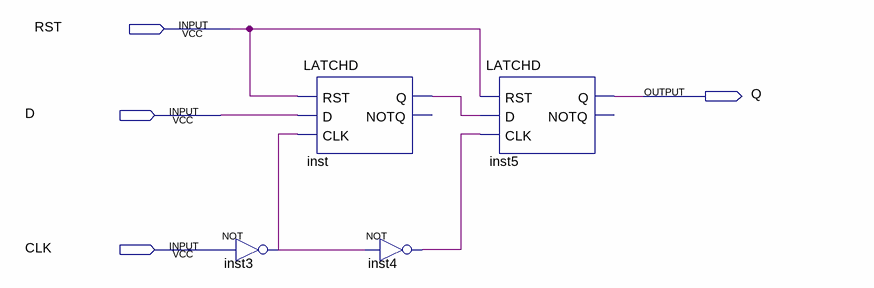
[diagram p0: schematic sheet]
// Quartus schematic FFD.bdf as structural Verilog: 4 symbols, 4 pins
module FFD (
  input  RST,
  input  D,
  input  CLK,
  output Q
);

  wire inst3_out, inst4_out, inst_q;

  not inst3 (inst3_out, CLK);
  LATCHD inst (.RST(RST), .D(D), .CLK(inst3_out), .Q(inst_q));  // open: NOTQ
  not inst4 (inst4_out, inst3_out);
  LATCHD inst5 (.RST(RST), .D(inst_q), .CLK(inst4_out), .Q(Q));  // open: NOTQ
endmodule
